# Altium schematic sheet MCU.SchDoc
size A4
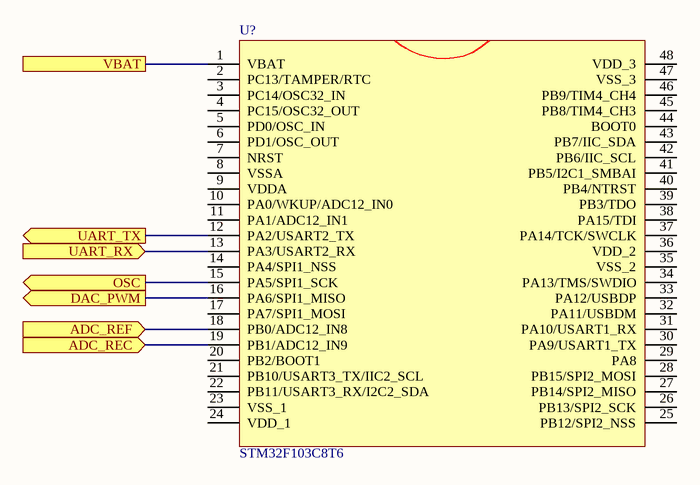
[diagram p0: MCU.SchDoc]

## Parts
U?  STM32F103C8T6  [LQFP48X]

## Ports
ADC_REC (in), ADC_REF (in), DAC_PWM (out), OSC (out), UART_RX (in), UART_TX (out), VBAT

## Nets
ADC_REC: U?.19(PB1/ADC12_IN9) ; port ADC_REC
ADC_REF: U?.18(PB0/ADC12_IN8) ; port ADC_REF
DAC_PWM: U?.16(PA6/SPI1_MISO) ; port DAC_PWM
OSC: U?.15(PA5/SPI1_SCK) ; port OSC
UART_RX: U?.13(PA3/USART2_RX) ; port UART_RX
UART_TX: U?.12(PA2/USART2_TX) ; port UART_TX
VBAT: U?.1(VBAT) ; port VBAT

Not connected (* = marked no-connect by the designer): U? 2(PC13/TAMPER/RTC) 3(PC14/OSC32_IN) 4(PC15/OSC32_OUT) 5(PD0/OSC_IN) 6(PD1/OSC_OUT) 7(NRST) 8(VSSA) 9(VDDA) 10(PA0/WKUP/ADC12_IN0) 11(PA1/ADC12_IN1) 14(PA4/SPI1_NSS) 17(PA7/SPI1_MOSI) 20(PB2/BOOT1) 21(PB10/USART3_TX/IIC2_SCL) 22(PB11/USART3_RX/I2C2_SDA) 23(VSS_1) 24(VDD_1) 25(PB12/SPI2_NSS) 26(PB13/SPI2_SCK) 27(PB14/SPI2_MISO) 28(PB15/SPI2_MOSI) 29(PA8) 30(PA9/USART1_TX) 31(PA10/USART1_RX) 32(PA11/USBDM) 33(PA12/USBDP) 34(PA13/TMS/SWDIO) 35(VSS_2) 36(VDD_2) 37(PA14/TCK/SWCLK) 38(PA15/TDI) 39(PB3/TDO) 40(PB4/NTRST) 41(PB5/I2C1_SMBAI) 42(PB6/IIC_SCL) 43(PB7/IIC_SDA) 44(BOOT0) 45(PB8/TIM4_CH3) 46(PB9/TIM4_CH4) 47(VSS_3) 48(VDD_3)